# Altium schematic sheet Pg5-Voltage signal condtioning.SchDoc: Analog Front End Opamp (Voltage)
size 431 x 279 mm; Date: Not shown in title block; ApprovedBy: Not shown in title block; CheckedBy: Not shown in title block; Author: Not shown in title block; CompanyName: Not shown in title block; Engineer: Not shown in title block; Organization: Not shown in title block; Address1: Not shown in title block; Address2: Not shown in title block; Address3: Not shown in title block; Address4: Not shown in title block; DocumentNumber: 4; Revision: Use project parameter SCH_Rev; SheetNumber: 5; SheetTotal: 9; PageSetup: Record=PageOptions|CenterHorizontal=True|CenterVertical=True|PrintScale=1.00|XCorrection=1.00|YCorrection=1.00|PrintKind=0|BorderSize=5000000|LeftOffset=0|BottomOffset=0|Orientation=2|PaperLength=1000|PaperWidth=1000|Scale=100|PaperSource=15|PrintQuality=600|MediaType=1|DitherType=10|PaperKind=Letter|PrintScaleMode=1; CurrentTime: Not shown in title block; CurrentDate: Not shown in title block; Time: Not shown in title block; DocumentFullPathAndName: Not shown in title block; DocumentName: Not shown in title block; ModifiedDate: Not shown in title block; ImagePath: Not shown in title block
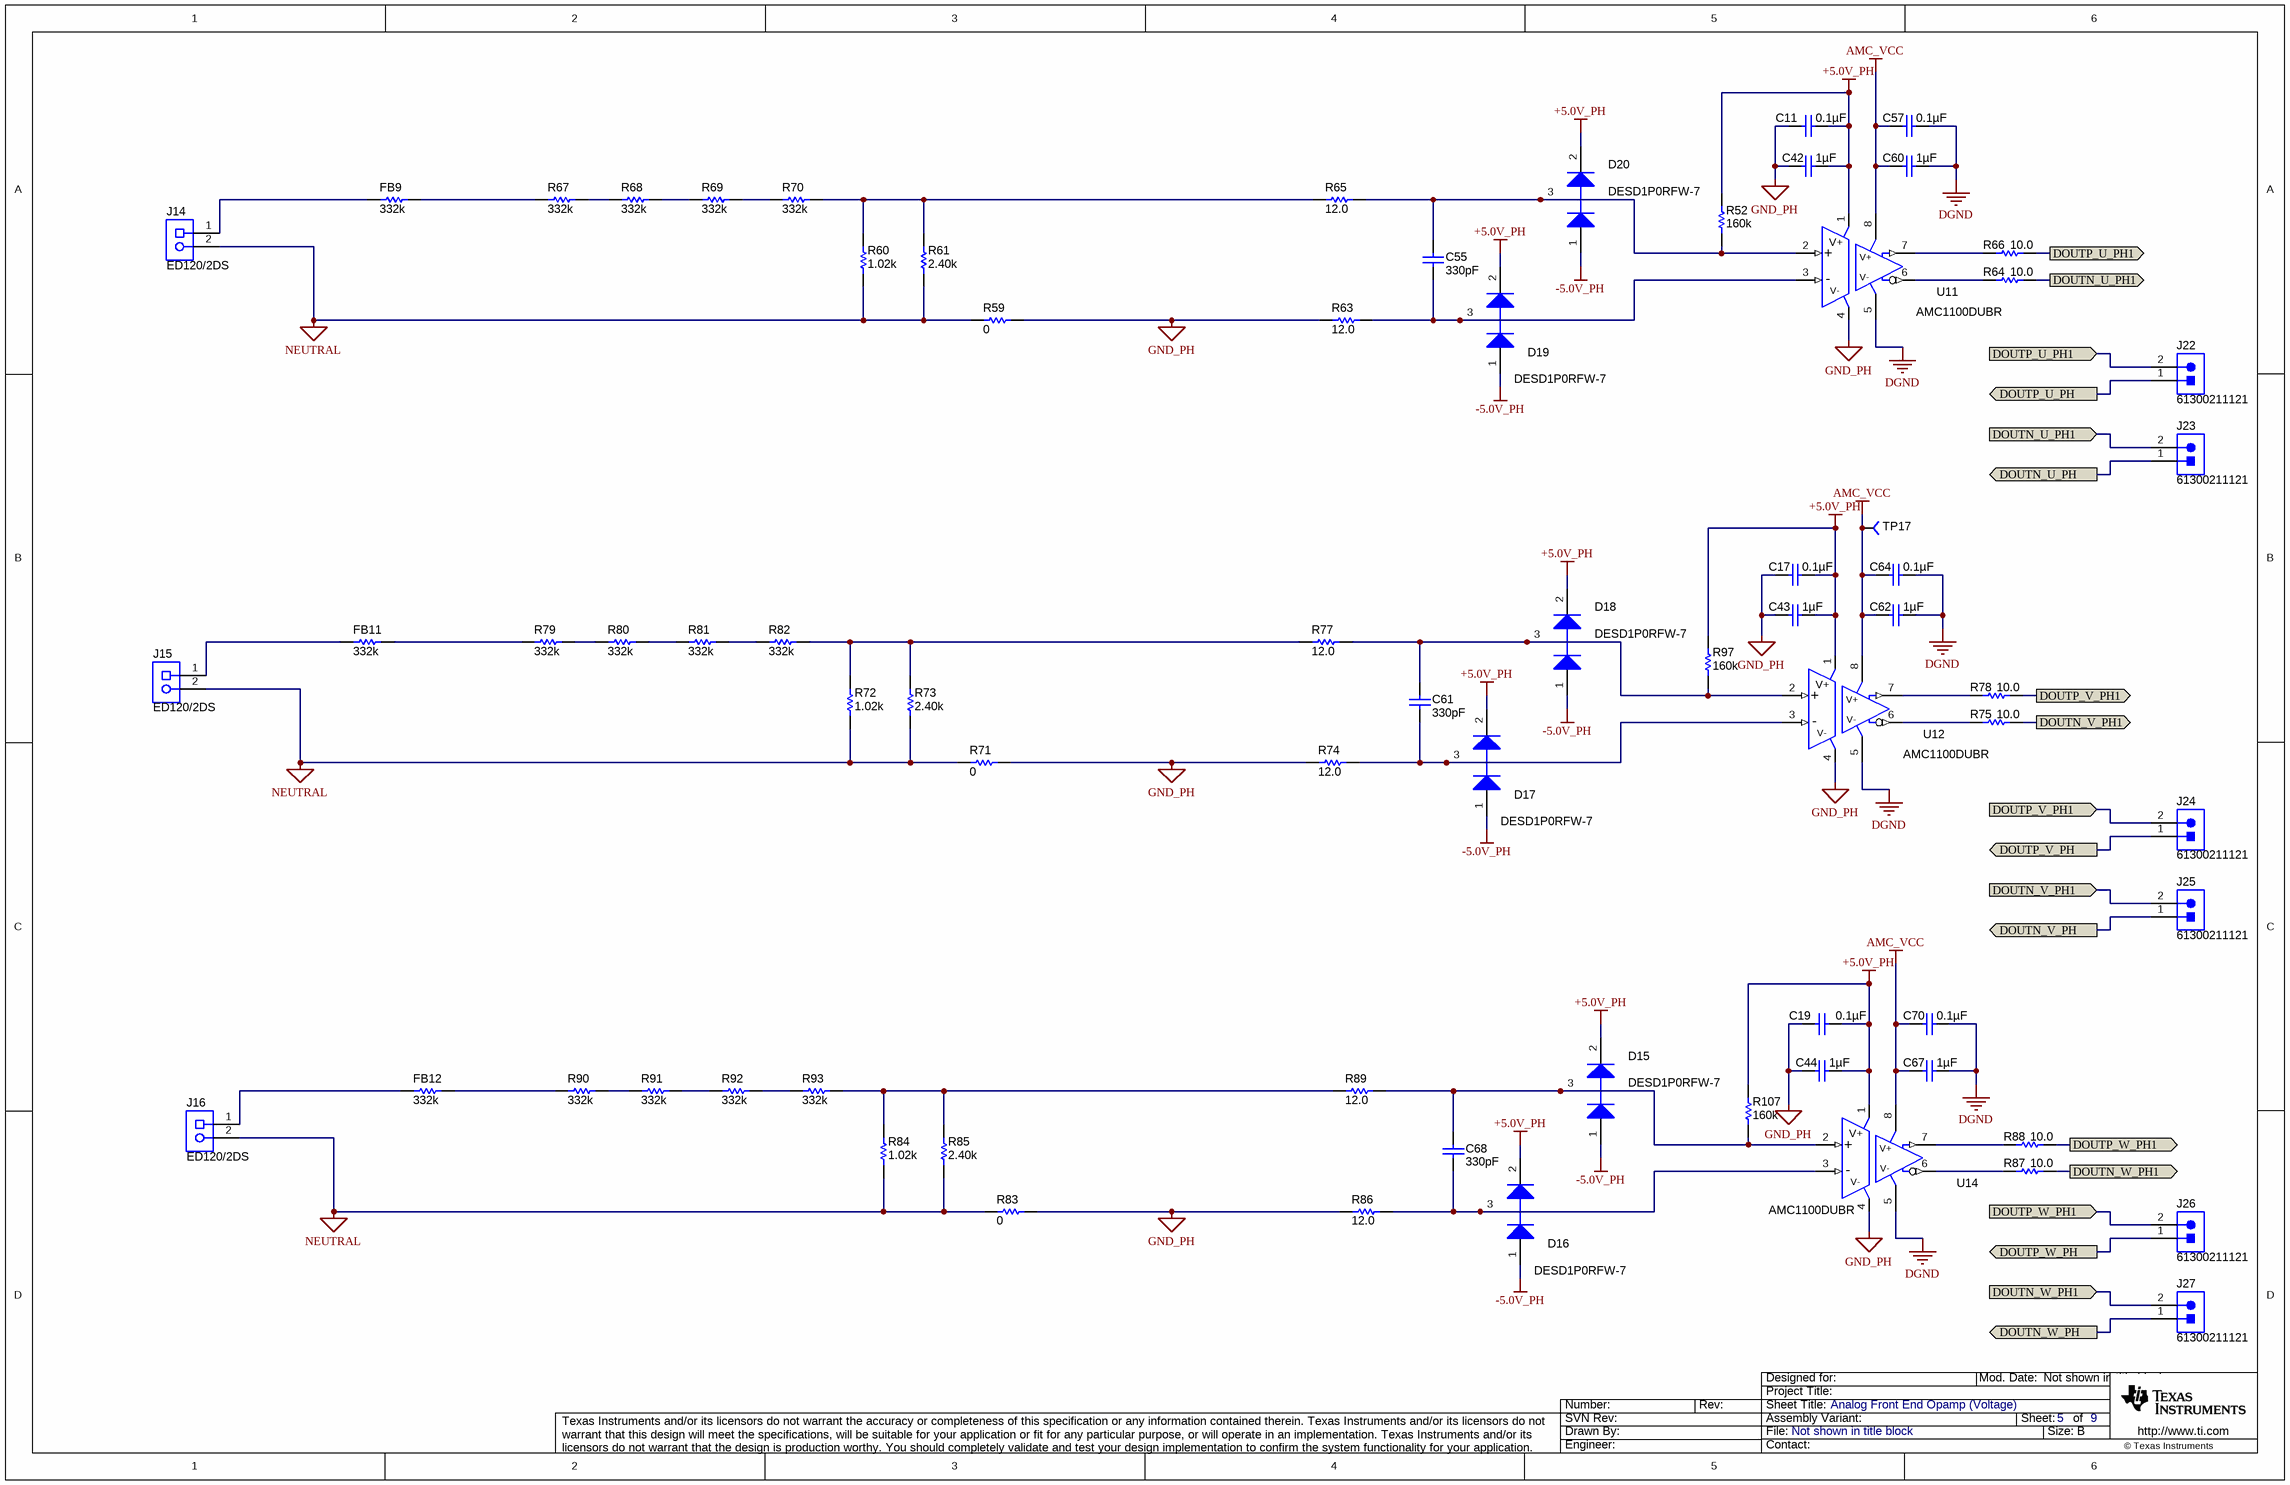
[diagram p0: Pg5-Voltage signal condtioning.SchDoc]

## Parts
C11  ValueDisplayed: 0.1µF  [0603]
C17  ValueDisplayed: 0.1µF  [0603]
C19  ValueDisplayed: 0.1µF  [0603]
C42  ValueDisplayed: 1µF  [0603]  (hidden comment: GRM188R71C105KA12D)
C43  ValueDisplayed: 1µF  [0603]  (hidden comment: GRM188R71C105KA12D)
C44  ValueDisplayed: 1µF  [0603]  (hidden comment: GRM188R71C105KA12D)
C55  ValueDisplayed: 330pF  [0805_HV]  (hidden comment: 08055A331KAT2A)
C57  ValueDisplayed: 0.1µF  [0603]
C60  ValueDisplayed: 1µF  [0603]  (hidden comment: GRM188R71C105KA12D)
C61  ValueDisplayed: 330pF  [0805_HV]  (hidden comment: 08055A331KAT2A)
C62  ValueDisplayed: 1µF  [0603]  (hidden comment: GRM188R71C105KA12D)
C64  ValueDisplayed: 0.1µF  [0603]
C67  ValueDisplayed: 1µF  [0603]  (hidden comment: GRM188R71C105KA12D)
C68  ValueDisplayed: 330pF  [0805_HV]  (hidden comment: 08055A331KAT2A)
C70  ValueDisplayed: 0.1µF  [0603]
D15  value DESD1P0RFW-7  [SOT-323]
D16  value DESD1P0RFW-7  [SOT-323]
D17  value DESD1P0RFW-7  [SOT-323]
D18  value DESD1P0RFW-7  [SOT-323]
D19  value DESD1P0RFW-7  [SOT-323]
D20  value DESD1P0RFW-7  [SOT-323]
FB9  ValueDisplayed: 332k  [1206]  (hidden comment: ERJ-8ENF3323V)
FB11  ValueDisplayed: 332k  [1206]  (hidden comment: ERJ-8ENF3323V)
FB12  ValueDisplayed: 332k  [1206]  (hidden comment: ERJ-8ENF3323V)
J14  ED120/2DS  [CONN_ED120-2DS]
J15  ED120/2DS  [CONN_ED120-2DS]
J16  ED120/2DS  [CONN_ED120-2DS]
J22  61300211121  [WURTH_61300211121]
J23  61300211121  [WURTH_61300211121]
J24  61300211121  [WURTH_61300211121]
J25  61300211121  [WURTH_61300211121]
J26  61300211121  [WURTH_61300211121]
J27  61300211121  [WURTH_61300211121]
R52  ValueDisplayed: 160k  [0603]  (hidden comment: CRCW0603160KFKEA)
R59  value 0  [0805_HV]  (hidden comment: CRCW08050000Z0EA)
R60  ValueDisplayed: 1.02k  [1206]  (hidden comment: RC1206FR-071K02L)
R61  ValueDisplayed: 2.40k  [1206]  (hidden comment: RC1206FR-072K4L)
R63  ValueDisplayed: 12.0  [0603]  (hidden comment: RC0603FR-0712RL)
R64  value 10.0  [0603]
R65  ValueDisplayed: 12.0  [0603]  (hidden comment: RC0603FR-0712RL)
R66  value 10.0  [0603]
R67  ValueDisplayed: 332k  [1206]  (hidden comment: ERJ-8ENF3323V)
R68  ValueDisplayed: 332k  [1206]  (hidden comment: ERJ-8ENF3323V)
R69  ValueDisplayed: 332k  [1206]  (hidden comment: ERJ-8ENF3323V)
R70  ValueDisplayed: 332k  [1206]  (hidden comment: ERJ-8ENF3323V)
R71  value 0  [0805_HV]  (hidden comment: CRCW08050000Z0EA)
R72  ValueDisplayed: 1.02k  [1206]  (hidden comment: RC1206FR-071K02L)
R73  ValueDisplayed: 2.40k  [1206]  (hidden comment: RC1206FR-072K4L)
R74  ValueDisplayed: 12.0  [0603]  (hidden comment: RC0603FR-0712RL)
R75  value 10.0  [0603]
R77  ValueDisplayed: 12.0  [0603]  (hidden comment: RC0603FR-0712RL)
R78  value 10.0  [0603]
R79  ValueDisplayed: 332k  [1206]  (hidden comment: ERJ-8ENF3323V)
R80  ValueDisplayed: 332k  [1206]  (hidden comment: ERJ-8ENF3323V)
R81  ValueDisplayed: 332k  [1206]  (hidden comment: ERJ-8ENF3323V)
R82  ValueDisplayed: 332k  [1206]  (hidden comment: ERJ-8ENF3323V)
R83  value 0  [0805_HV]  (hidden comment: CRCW08050000Z0EA)
R84  ValueDisplayed: 1.02k  [1206]  (hidden comment: RC1206FR-071K02L)
R85  ValueDisplayed: 2.40k  [1206]  (hidden comment: RC1206FR-072K4L)
R86  ValueDisplayed: 12.0  [0603]  (hidden comment: RC0603FR-0712RL)
R87  value 10.0  [0603]
R88  value 10.0  [0603]
R89  ValueDisplayed: 12.0  [0603]  (hidden comment: RC0603FR-0712RL)
R90  ValueDisplayed: 332k  [1206]  (hidden comment: ERJ-8ENF3323V)
R91  ValueDisplayed: 332k  [1206]  (hidden comment: ERJ-8ENF3323V)
R92  ValueDisplayed: 332k  [1206]  (hidden comment: ERJ-8ENF3323V)
R93  ValueDisplayed: 332k  [1206]  (hidden comment: ERJ-8ENF3323V)
R97  ValueDisplayed: 160k  [0603]  (hidden comment: CRCW0603160KFKEA)
R107  ValueDisplayed: 160k  [0603]  (hidden comment: CRCW0603160KFKEA)
TP17  (no value)  [TP-040_RND]
U11  AMC1100DUBR  [DUB0008A_N]
U12  AMC1100DUBR  [DUB0008A_N]
U14  AMC1100DUBR  [DUB0008A_N]

## Ports
DOUTN_U_PH1 (in), DOUTN_U_PH1 (out), DOUTN_U_PH (out), DOUTN_V_PH1 (in), DOUTN_V_PH1 (out), DOUTN_V_PH (out), DOUTN_W_PH1 (in), DOUTN_W_PH1 (out), DOUTN_W_PH (out), DOUTP_U_PH1 (in), DOUTP_U_PH1 (out), DOUTP_U_PH (out), DOUTP_V_PH1 (in), DOUTP_V_PH1 (out), DOUTP_V_PH (out), DOUTP_W_PH1 (in), DOUTP_W_PH1 (out), DOUTP_W_PH (out)

## Nets
+5.0V_PH: C11.1 C17.1 C19.1 C42.2 C43.2 C44.2 D15.2(K) D16.2(K) D17.2(K) D18.2(K) D19.2(K) D20.2(K) R52.2 R97.2 R107.2 U11.1(VDD1) U12.1(VDD1) U14.1(VDD1)
-5.0V_PH: D15.1(A) D16.1(A) D17.1(A) D18.1(A) D19.1(A) D20.1(A)
AMC_VCC: C57.2 C60.1 C62.1 C64.2 C67.1 C70.2 TP17.1 U11.8(VDD2) U12.8(VDD2) U14.8(VDD2)
DGND: C57.1 C60.2 C62.2 C64.1 C67.2 C70.1 U11.5(GND2) U12.5(GND2) U14.5(GND2)
GND_PH: C11.2 C17.2 C19.2 C42.1 C43.1 C44.1 R59.2 R63.1 R71.2 R74.1 R83.2 R86.1 U11.4(GND1) U12.4(GND1) U14.4(GND1)
NEUTRAL: J14.2 J15.2 J16.2 R59.1 R60.1 R61.1 R71.1 R72.1 R73.1 R83.1 R84.1 R85.1
DOUTN_U_PH: J23.1 ; port DOUTN_U_PH
DOUTN_U_PH1: J23.2 R64.2 ; port DOUTN_U_PH1
DOUTN_V_PH: J25.1 ; port DOUTN_V_PH
DOUTN_V_PH1: J25.2 R75.2 ; port DOUTN_V_PH1
DOUTN_W_PH: J27.1 ; port DOUTN_W_PH
DOUTN_W_PH1: J27.2 R87.2 ; port DOUTN_W_PH1
DOUTP_U_PH: J22.1 ; port DOUTP_U_PH
DOUTP_U_PH1: J22.2 R66.2 ; port DOUTP_U_PH1
DOUTP_V_PH: J24.1 ; port DOUTP_V_PH
DOUTP_V_PH1: J24.2 R78.2 ; port DOUTP_V_PH1
DOUTP_W_PH: J26.1 ; port DOUTP_W_PH
DOUTP_W_PH1: J26.2 R88.2 ; port DOUTP_W_PH1
NetC55_1: C55.1 D20.3(C) R52.1 R65.2 U11.2(VINP)
NetC55_2: C55.2 D19.3(C) R63.2 U11.3(VINN)
NetC61_1: C61.1 D18.3(C) R77.2 R97.1 U12.2(VINP)
NetC61_2: C61.2 D17.3(C) R74.2 U12.3(VINN)
NetC68_1: C68.1 D15.3(C) R89.2 R107.1 U14.2(VINP)
NetC68_2: C68.2 D16.3(C) R86.2 U14.3(VINN)
NetFB9_1: FB9.1 J14.1
NetFB9_2: FB9.2 R67.1
NetFB11_1: FB11.1 J15.1
NetFB11_2: FB11.2 R79.1
NetFB12_1: FB12.1 J16.1
NetFB12_2: FB12.2 R90.1
NetR60_2: R60.2 R61.2 R65.1 R70.2
NetR64_1: R64.1 U11.6(VOUTN)
NetR66_1: R66.1 U11.7(VOUTP)
NetR67_2: R67.2 R68.1
NetR68_2: R68.2 R69.1
NetR69_2: R69.2 R70.1
NetR72_2: R72.2 R73.2 R77.1 R82.2
NetR75_1: R75.1 U12.6(VOUTN)
NetR78_1: R78.1 U12.7(VOUTP)
NetR79_2: R79.2 R80.1
NetR80_2: R80.2 R81.1
NetR81_2: R81.2 R82.1
NetR84_2: R84.2 R85.2 R89.1 R93.2
NetR87_1: R87.1 U14.6(VOUTN)
NetR88_1: R88.1 U14.7(VOUTP)
NetR90_2: R90.2 R91.1
NetR91_2: R91.2 R92.1
NetR92_2: R92.2 R93.1

## Notes on the sheet
- Drawn By:
- SVN Rev:
- Number:
- Rev:
- Sheet Title:
- File:
- Project Title:
- Designed for:
- Assembly Variant:
- Mod. Date:
- Sheet:
- Size:
- of
- B
- http://www.ti.com
- Texas Instruments and/or its licensors do not warrant the accuracy or completeness of this specification or any information contained therein. Texas Instruments and/or its licensors do not warrant that this design will meet the specifications, will be suitable for your application or fit for any particular purpose, or will operate in an implementation. Texas Instruments and/or its licensors do not warrant that the design is production worthy. You should completely validate and test your design implementation to confirm the system functionality for your application.
- Engineer:
- Contact:
- © Texas Instruments
- (in symbol AMC1100DUBR) V+; +; -; V-

## Library data of the parts
C11 C17 C19 C57 C64 C70 = 06033C104JAT2A: CAP, CERM, 0.1uF, 25V, +/-5%, X7R, 0603; Manufacturer: AVX; Polarized: N; CompType: Capacitor; U/M: EA; Cap_F: 0.0000001; Tolerance_%: 5; ESR_Ohm: 0.05; Value1: 0.05 ohm; VDC_V: 25; TaMin_C: -55; TaMax_C: 125; SymbolVersion: 2008-07-09; Value: 0.1uF; PartNumber: 06033C104JAT2A; PackageReference: 0603; RoHS: Y; Value2: 25V; MountType: SMT; Technology: Ceramic; TempCo: X7R; Cap_Case: 0603; Published: 2008-06-19; Publisher: Texas Instruments; LatestRevisionDate: 2013-12-06; ComponentLink1Description: Datasheet link; ComponentLink1URL: http://www.avx.com/docs/masterpubs/smccp.pdf; Supplier 1: Digi-Key; Supplier Part Number 1: 478-3713-1-ND; Supplier 2: Mouser; Supplier Part Number 2: 581-06033C104JAT2A; Supplier 3: Farnell; Supplier Part Number 3: 1740614
C42-C44 C60 C62 C67 = GRM188R71C105KA12D: CAP, CERM, 1 µF, 16 V, +/- 10%, X7R, 0603; Manufacturer: MuRata; Polarized: N; CompType: Capacitor; Value: 1uF; U/M: EA; Cap_F: 0.000001; Tolerance_%: 10; ESR_ohm: 0.011; Value1: 0.011 ohm; VDC_V: 16; Value2: 16V; TaMin_C: -55; TaMax_C: 125; SymbolVersion: 2008-07-09; PartNumber: GRM188R71C105KA12D; PackageReference: 0603; RoHS: Y; MountType: SMT; Technology: Ceramic; TempCo: X7R; Cap_Case: 0603; Published: 2008-06-19; Publisher: Texas Instruments; LatestRevisionDate: 2015-02-10; ComponentLink1Description: Datasheet link; ComponentLink1URL: http://search.murata.co.jp/Ceramy/PnsearchViewAction.do?HnOFG=ON&HnNFG=ON&SEL_CNT=50&sLang=en&sKey=GRM188R71C105KA12D&x=9&y=9&search=startwith; Supplier 1: Digi-Key; Supplier Part Number 1: 490-3900-1-ND; Supplier 2: Mouser; Supplier Part Number 2: 81-GRM188R71C105KA12; Supplier 3: Farnell; Supplier Part Number 3: 1828826
C55 C61 C68 = 08055A331KAT2A: CAP, CERM, 330 pF, 50 V, +/- 10%, C0G/NP0, 0805; Manufacturer: AVX; Polarized: N; CompType: Capacitor; Value: 330pF; U/M: EA; Cap_F: 0.00000000033; Tolerance_%: 10; ESR_ohm: 0.189; Value1: 0.189 ohm; VDC_V: 50; Value2: 50V; TaMin_C: -55; TaMax_C: 125; Cap_Case: 0805; SymbolVersion: 2008-07-09; PartNumber: 08055A331KAT2A; PackageReference: 0805; RoHS: Y; MountType: SMT; Technology: Ceramic; TempCo: C0G/NP0; Published: 2008-06-19; Publisher: Texas Instruments; LatestRevisionDate: 2015-02-10; ComponentLink1Description: Datasheet link; ComponentLink1URL: http://www.avx.com/docs/masterpubs/smccp.pdf; Supplier 1: Digi-Key; Supplier Part Number 1: 478-3765-1-ND; Supplier 2: Mouser; Supplier Part Number 2: 581-08055A331K; Supplier 3: Farnell; Supplier Part Number 3: 1582411
D15-D20 = BAV99WT1G: Diode, P-N, 70V, 0.2A, SOT-323; Manufacturer: Diodes Inc; SymbolVersion: 2011-08-17; PartNumber: DESD1P0RFW-7; PackageReference: SOT-323; CompType: Diode; MountType: SMT; Type: P-N; RoHS: Y; Published: 2008-06-26; Publisher: Texas Instruments; LatestRevisionDate: 2013-11-22; ComponentLink1Description: Datasheet link; ComponentLink1URL: http://www.diodes.com/datasheets/DESD1P0RFW.pdf; Supplier 1: Digi-Key; Supplier Part Number 1: DESD1P0RFW-7DIDKR-ND; Supplier 2: Mouser; Supplier Part Number 2: 512-BAV99WT1G
FB9 FB11 FB12 R67-R70 R79-R82 R90-R93 = ERJ-8ENF3323V: RES, 332 k, 1%, 0.25 W, 1206; Manufacturer: Panasonic; CompType: Resistor; Value: 332k; Res_ohm: 332000; Tolerance_%: 1; Power_W: 0.25; Value2: 0.25W; VDC_V: 200; TempCo: 100 ppm/C; EIA_Code: E96; U/M: EA; SymbolVersion: 2009-05-29; PartNumber: ERJ-8ENF3323V; PackageReference: 1206; RoHS: Y; Value_Code: 332k; Value1: 1%; MountType: SMT; Technology: Thick Film; Published: 2008-06-26; Publisher: Texas Instruments; LatestRevisionDate: 2015-02-02; ComponentLink1Description: Datasheet link; ComponentLink1URL: http://www.panasonic.com/industrial/components/pdf/AOA0000CE2.pdf; Supplier 1: Digi-Key; Supplier Part Number 1: P332KFCT-ND; Supplier 2: Farnell; Supplier Part Number 2: 2057756
J14-J16 = ED120/2DS: TERMINAL BLOCK 5.08MM VERT 2POS, TH; Manufacturer: On-Shore Technology; SymbolCreator: a0412235; U/M: EA; SymbolVersion: 2013-09-04; PartNumber: ED120/2DS; PackageReference: TERM_BLK, 2pos, 5.08mm; CompType: Terminal Block; RoHS: Y; MountType: TH; ComponentLink1Description: Datasheet Link; ComponentLink1URL: http://www.on-shore.com/sites/default/files/manuals/ed120ds.pdf; Publisher: Texas Instruments; LatestRevisionDate: 2013-12-06; Supplier 1: Digi-Key; Supplier Part Number 1: ED1609-ND
J22-J27 = 61300211121: Header, 2.54 mm, 2x1, Gold, TH; Manufacturer: Wurth Elektronik eiSos; SymbolCreator: a0412235; U/M: EA; SymbolVersion: 2013-10-31; PartNumber: 61300211121; PackageReference: Header, 2.54mm, 2x1, TH; CompType: Header; RoHS: Y; MountType: TH; ComponentLink1Description: Datasheet Link; ComponentLink1URL: http://katalog.we-online.de/em/datasheet/6130xx11121.pdf; Publisher: Texas Instruments; LatestRevisionDate: 2014-11-22; Supplier 1: Digi-Key; Supplier Part Number 1: 732-5315-ND; Supplier 2: Mouser; Supplier Part Number 2: 710-61300211121; Supplier 3: Farnell; Supplier Part Number 3: 2356153; ClassName: Header
R52 R97 R107 = CRCW0603160KFKEA: RES, 160 k, 1%, 0.1 W, 0603; Manufacturer: Vishay-Dale; CompType: Resistor; Value: 160k; Res_ohm: 160000; Tolerance_%: 1; Power_W: 0.1; Value2: 0.1W; VDC_V: 75; TempCo: 100 ppm/C; U/M: EA; SymbolVersion: 2009-05-29; PartNumber: CRCW0603160KFKEA; PackageReference: 0603; RoHS: Y; Value_Code: 160k; Value1: 1%; MountType: SMT; Technology: Thick Film; Published: 2008-06-26; Publisher: Texas Instruments; LatestRevisionDate: 2015-04-01; ComponentLink1Description: Datasheet link; ComponentLink1URL: http://www.vishay.com/docs/20035/dcrcwe3.pdf; Supplier 1: Digi-Key; Supplier Part Number 1: 541-160KHCT-ND; Supplier 2: Mouser; Supplier Part Number 2: 71-CRCW0603-160K-E3; Supplier 3: Farnell; Supplier Part Number 3: 1151729
R59 R71 R83 = CRCW08050000Z0EA: RES, 0 ohm, 5%, 0.125W, 0805; Manufacturer: Vishay-Dale; CompType: Resistor; Value_Code: 0000; Tolerance_%: 5; Power_W: 0.125; VDC_V: 150; TempCo: 200 ppm/C; EIA_Code: E24; U/M: EA; SymbolVersion: 2009-05-29; PartNumber: CRCW08050000Z0EA; PackageReference: 0805; RoHS: Y; Res_ohm: 0; Value1: 5%; Value2: 0.125W; MountType: SMT; Technology: Thick Film; Published: 2008-06-26; Publisher: Texas Instruments; LatestRevisionDate: 2014-04-18; ComponentLink1Description: Datasheet link; ComponentLink1URL: http://www.vishay.com/docs/20035/dcrcwe3.pdf; Supplier 1: Digi-Key; Supplier Part Number 1: 541-0.0ACT-ND; Supplier 2: Mouser; Supplier Part Number 2: 71-CRCW0805-0-E3; Supplier 3: Farnell; Supplier Part Number 3: 1469846
R60 R72 R84 = RC1206FR-072K4L: RES SMD 1.02K OHM 1% 1/4W 1206; Manufacturer: Yageo America; CompType: Resistor; Res_ohm: 2400; Value_Code: 1K02; Tolerance_%: 1; Power_W: 0.25; Value2: 0.25W; VDC_V: 200; TempCo: 100 ppm/C; U/M: EA; SymbolVersion: 2009-05-29; Value: 1.02k; PartNumber: RC1206FR-071K02L; PackageReference: 1206; RoHS: Y; Value1: 1%; MountType: SMT; Technology: Thick Film; Published: 2008-06-26; Publisher: Texas Instruments; LatestRevisionDate: 2015-02-02; ComponentLink1Description: Datasheet link; ComponentLink1URL: http://www.yageo.com/pdf/Pu-RC1206_51_PbFree_L_2.pdf; Supplier 1: Digi-Key; Supplier Part Number 1: 311-1.02KFRCT-ND
R61 R73 R85 = RC1206FR-072K4L: RES, 2.40 k, 1%, 0.25 W, 1206; Manufacturer: Yageo America; CompType: Resistor; Value: 2.40k; Res_ohm: 2400; Value_Code: 2k40; Tolerance_%: 1; Power_W: 0.25; Value2: 0.25W; VDC_V: 200; TempCo: 100 ppm/C; U/M: EA; SymbolVersion: 2009-05-29; PartNumber: RC1206FR-072K4L; PackageReference: 1206; RoHS: Y; Value1: 1%; MountType: SMT; Technology: Thick Film; Published: 2008-06-26; Publisher: Texas Instruments; LatestRevisionDate: 2015-02-02; ComponentLink1Description: Datasheet link; ComponentLink1URL: http://www.yageo.com/pdf/Pu-RC1206_51_PbFree_L_2.pdf; Supplier 1: Digi-Key; Supplier Part Number 1: 311-2.40KFRCT-ND; Supplier 2: Mouser; Supplier Part Number 2: 603-RC1206FR-072K4L; Supplier 3: Farnell; Supplier Part Number 3: 1100199
R63 R65 R74 R77 R86 R89 = RC0603FR-0712RL: RES, 12.0, 1%, 0.1 W, 0603; Manufacturer: Yageo America; CompType: Resistor; Value: 12.0; Res_ohm: 12; Value_Code: 12R0; Tolerance_%: 1; Power_W: 0.1; Value2: 0.1W; VDC_V: 150; TempCo: 200 ppm/C; U/M: EA; SymbolVersion: 2009-05-29; PartNumber: RC0603FR-0712RL; PackageReference: 0603; RoHS: Y; Value1: 1%; MountType: SMT; Technology: Thick Film; Published: 2008-06-26; Publisher: Texas Instruments; LatestRevisionDate: 2014-12-16; ComponentLink1Description: Datasheet link; ComponentLink1URL: http://www.yageo.com/pdf/Pu-RC0603_51_PbFree_L_2.pdf; Supplier 1: Digi-Key; Supplier Part Number 1: 311-12.0HRCT-ND; Supplier 2: Mouser; Supplier Part Number 2: 603-RC0603FR-0712RL; Supplier 3: Farnell; Supplier Part Number 3: 9238255
R64 R66 R75 R78 R87 R88 = CRCW060310R0FKEA: RES, 10.0 ohm, 1%, 0.1W, 0603; Manufacturer: Vishay-Dale; CompType: Resistor; Res_ohm: 10; Value_Code: 10R0; Tolerance_%: 1; Power_W: 0.1; VDC_V: 75; TempCo: 100 ppm/C; EIA_Code: E96; U/M: EA; SymbolVersion: 2009-05-29; PartNumber: CRCW060310R0FKEA; PackageReference: 0603; RoHS: Y; Value1: 1%; Value2: 0.1W; MountType: SMT; Technology: Thick Film; Published: 2008-06-26; Publisher: Texas Instruments; LatestRevisionDate: 2013-10-22; ComponentLink1Description: Datasheet link; ComponentLink1URL: http://www.vishay.com/docs/20035/dcrcwe3.pdf; Supplier 1: Digi-Key; Supplier Part Number 1: 541-10.0HCT-ND; Supplier 2: Mouser; Supplier Part Number 2: 71-CRCW0603-10-E3; Supplier 3: Farnell; Supplier Part Number 3: 1469751
TP17 = TP-040_RND: Test Point, O.040 Hole; Manufacturer: STD; Value: STD; area: *; SymbolVersion: 06/30/2008 16:03:57; PartNumber: STD; ComponentLink1Description: AEO Datasheet Link
U11 U12 U14 = AMC1100DUBR: Fully-Differential Isolation Amplifier, DUB0008A; Manufacturer: Texas Instruments; SymbolCreator: a0411947; CompType: IC; U/M: EA; SymbolVersion: 2013-07-01; PartNumber: AMC1100DUBR; Alternate PartNumber: AMC1100DUB; PackageReference: DUB0008A; MountType: SMT; ComponentLink1Description: Datasheet Link; ComponentLink1URL: https://sps06.itg.ti.com/sites/KMS/crossdivteams/altium/docs/ComponentDatasheets/AMC1200.pdf; RoHS: Y; Publisher: Texas Instruments; LatestRevisionDate: 2015-02-10; Alternate Manufacturer: Texas Instruments